# Altium schematic sheet SSI2130.SchDoc: SSI2130 VCO
size Letter; DrawnBy: Hannah Kirkland; Revision: 1; SheetNumber: 1
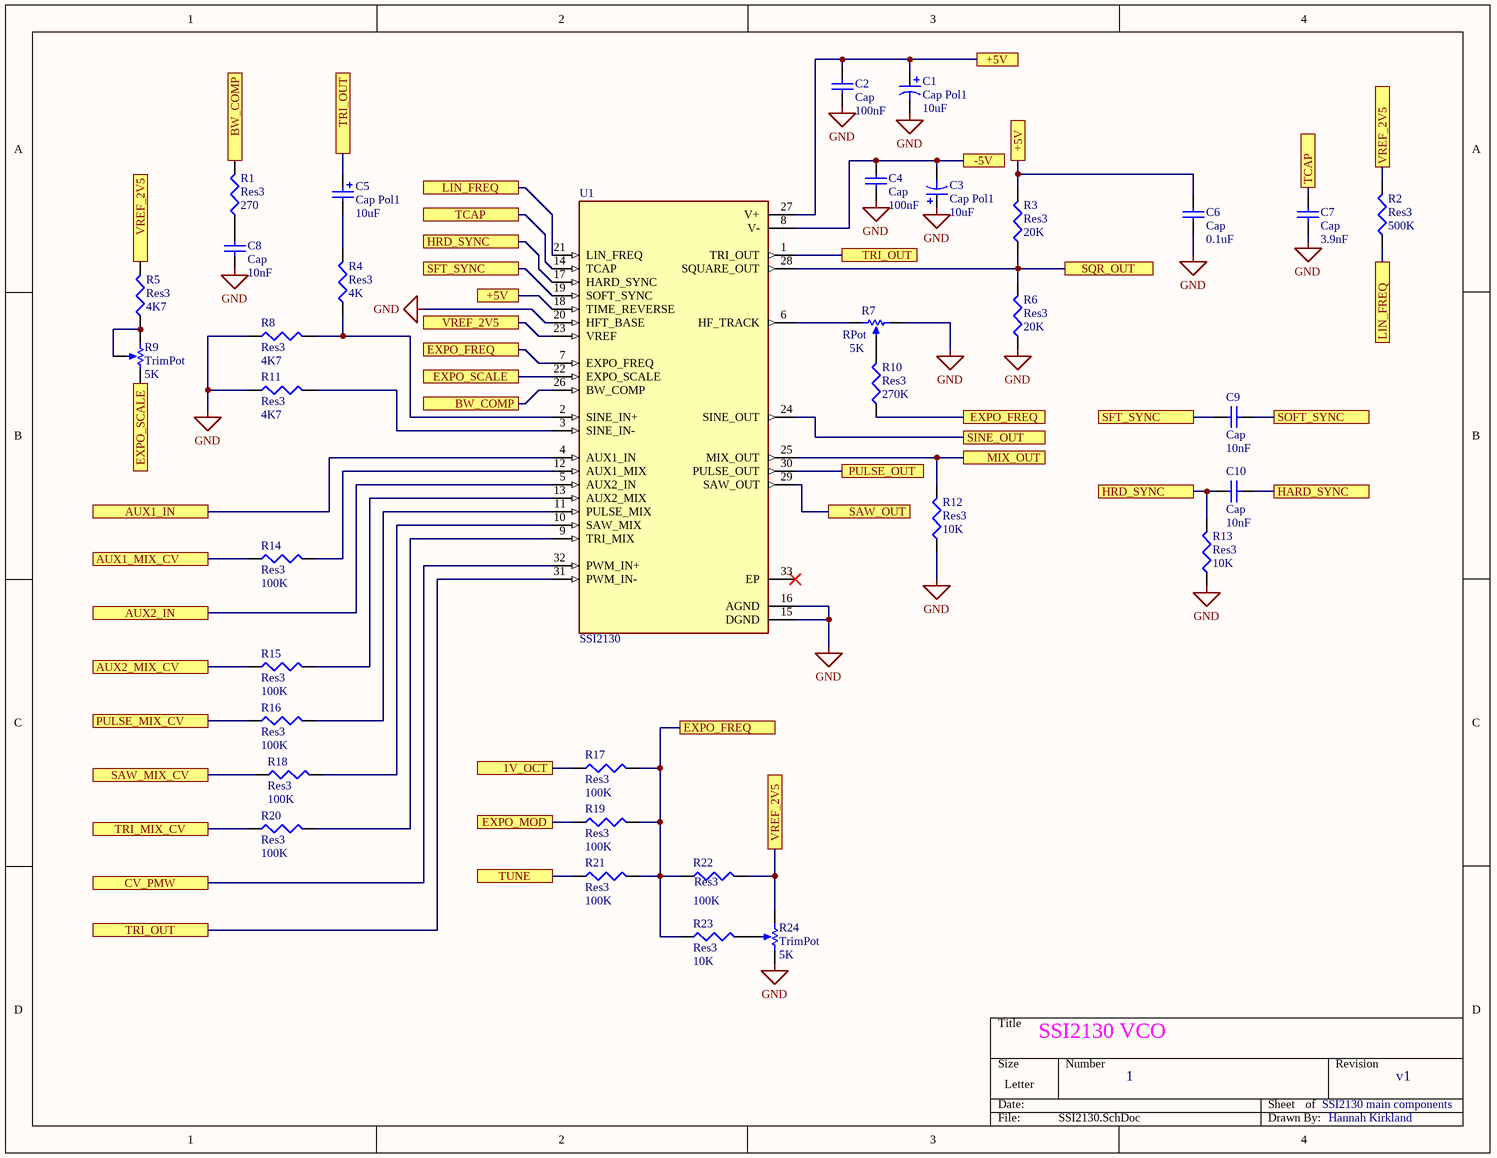
[diagram p0: SSI2130.SchDoc]

## Parts
C1  Cap Pol1  value 10uF  [RB7.6-15]
C2  Cap  value 100nF  [C1206]
C3  Cap Pol1  value 10uF  [RB7.6-15]
C4  Cap  value 100nF  [C1206]
C5  Cap Pol1  value 10uF  [RB7.6-15]
C6  Cap  value 0.1uF  [C1206]
C7  Cap  value 3.9nF  [C1206]
C8  Cap  value 10nF  [C1206]
C9  Cap  value 10nF  [C1206]
C10  Cap  value 10nF  [C1206]
R1  Res3  value 270  [C1206]
R2  Res3  value 500K  [12Z-2010]
R3  Res3  value 20K  [C1206]
R4  Res3  value 4K  [C1206]
R5  Res3  value 4K7  [C1206]
R6  Res3  value 20K  [C1206]
R7  RPot  value 5K  [VR5]
R8  Res3  value 4K7  [C1206]
R9  TrimPot  value 5K  [VR5]
R10  Res3  value 270K  [C1206]
R11  Res3  value 4K7  [C1206]
R12  Res3  value 10K  [C1206]
R13  Res3  value 10K  [C1206]
R14  Res3  value 100K  [C1206]
R15  Res3  value 100K  [C1206]
R16  Res3  value 100K  [C1206]
R17  Res3  value 100K  [C1206]
R18  Res3  value 100K  [C1206]
R19  Res3  value 100K  [C1206]
R20  Res3  value 100K  [C1206]
R21  Res3  value 100K  [C1206]
R22  Res3  value 100K  [C1206]
R23  Res3  value 10K  [C1206]
R24  TrimPot  value 5K  [VR5]
U1  SSI2130  [QFN40P400X400X90-33N]

## Ports
1V_OCT, +5V, -5V, AUX1_IN, AUX1_MIX_CV, AUX2_IN, AUX2_MIX_CV, BW_COMP, CV_PMW, EXPO_FREQ, EXPO_MOD, EXPO_SCALE, HARD_SYNC, HRD_SYNC, LIN_FREQ, MIX_OUT, PULSE_MIX_CV, PULSE_OUT, SAW_MIX_CV, SAW_OUT, SFT_SYNC, SINE_OUT, SOFT_SYNC, SQR_OUT, TCAP, TRI_MIX_CV, TRI_OUT, TUNE, VREF_2V5

## Nets
GND: C1.2 C2.1 C3.1 C4.1 C6.1 C7.1 C8.1 R6.1 R7.2(BOT) R8.1 R11.1 R12.1 R13.1 R24.2(BOT) U1.15(DGND) U1.16(AGND) U1.20(HFT_BASE)
1V_OCT: R17.1 ; port 1V_OCT
+5V: C1.1 C2.2 C6.2 R3.2 U1.18(TIME_REVERSE) U1.27(V+) ; port +5V
-5V: C3.2 C4.2 U1.8(V-) ; port -5V
AUX1_IN: U1.4(AUX1_IN) ; port AUX1_IN
AUX1_MIX_CV: R14.1 ; port AUX1_MIX_CV
AUX2_IN: U1.5(AUX2_IN) ; port AUX2_IN
AUX2_MIX_CV: R15.1 ; port AUX2_MIX_CV
BW_COMP: R1.2 U1.26(BW_COMP) ; port BW_COMP
CV_PMW: U1.32(PWM_IN+) ; port CV_PMW
EXPO_FREQ: R10.1 R17.2 R19.2 R21.2 R22.1 R23.1 U1.7(EXPO_FREQ) ; port EXPO_FREQ
EXPO_MOD: R19.1 ; port EXPO_MOD
EXPO_SCALE: R9.2(BOT) U1.22(EXPO_SCALE) ; port EXPO_SCALE
HARD_SYNC: C10.2 ; port HARD_SYNC
HRD_SYNC: C10.1 R13.2 U1.17(HARD_SYNC) ; port HRD_SYNC
LIN_FREQ: R2.1 U1.21(LIN_FREQ) ; port LIN_FREQ
MIX_OUT: R12.2 U1.25(MIX_OUT) ; port MIX_OUT
PULSE_MIX_CV: R16.1 ; port PULSE_MIX_CV
PULSE_OUT: U1.30(PULSE_OUT) ; port PULSE_OUT
SAW_MIX_CV: R18.1 ; port SAW_MIX_CV
SAW_OUT: U1.29(SAW_OUT) ; port SAW_OUT
SFT_SYNC: C9.1 U1.19(SOFT_SYNC) ; port SFT_SYNC
SINE_OUT: U1.24(SINE_OUT) ; port SINE_OUT
SOFT_SYNC: C9.2 ; port SOFT_SYNC
SQR_OUT: R3.1 R6.2 U1.28(SQUARE_OUT) ; port SQR_OUT
TCAP: C7.2 U1.14(TCAP) ; port TCAP
TRI_MIX_CV: R20.1 ; port TRI_MIX_CV
TRI_OUT: C5.1 U1.1(TRI_OUT) U1.31(PWM_IN-) ; port TRI_OUT
TUNE: R21.1 ; port TUNE
VREF_2V5: R2.2 R5.2 R22.2 R24.1(TOP) U1.23(VREF) ; port VREF_2V5
NetC5_2: C5.2 R4.2
NetC8_2: C8.2 R1.1
NetR4_1: R4.1 R8.2 U1.2(SINE_IN+)
NetR5_1: R5.1 R9.1(TOP) R9.3(TAP)
NetR7_1: R7.1(TOP) U1.6(HF_TRACK)
NetR7_3: R7.3(TAP) R10.2
NetR11_2: R11.2 U1.3(SINE_IN-)
NetR14_2: R14.2 U1.12(AUX1_MIX)
NetR15_2: R15.2 U1.13(AUX2_MIX)
NetR16_2: R16.2 U1.11(PULSE_MIX)
NetR18_2: R18.2 U1.10(SAW_MIX)
NetR20_2: R20.2 U1.9(TRI_MIX)
NetR23_2: R23.2 R24.3(TAP)

Not connected (* = marked no-connect by the designer): U1 33(EP)*

## Notes on the sheet
- SSI2130 VCO
- 1
- SSI2130 main components
- v1
- Hannah Kirkland

## Library data of the parts
C1 C3 C5 = Cap Pol1: Polarized Capacitor (Radial); Published: 8-Jun-2000; LatestRevisionDate: 17-Jul-2002; LatestRevisionNote: Re-released for DXP Platform.; PackageReference: RB7.6-15; Publisher: Altium Limited; PackageDescription: Polarized Capacitor (Radial); 2 Leads
C2 C4 C6-C10 = Cap: Capacitor; Published: 8-Jun-2000; LatestRevisionDate: 17-Jul-2002; LatestRevisionNote: Re-released for DXP Platform.; PackageReference: RAD-0.3; Publisher: Altium Limited; PackageDescription: Radial Cap, Thru-Hole; 2 Leads; 0.3 in Pin Spacing
R1-R6 R8 R10-R23 = Res3: Resistor; Published: 8-Jun-2000; LatestRevisionDate: 29-May-2009; LatestRevisionNote: IPC-7351 Footprint Added.; PackageReference: J1-0603; Publisher: Altium Limited; PackageDescription: Chip Resistor
R7 R9 R24 = RPot: Potentiometer; Sim Note: Enter the Resistance value and the set point into parameter fields.; Set Position: 0.5; Published: 8-Jun-2000; LatestRevisionDate: 17-Jul-2002; LatestRevisionNote: Re-released for DXP Platform.; PackageReference: VR5; Publisher: Altium Limited; PackageDescription: Variable Resistor, Thru-Hole; 3 Leads
U1 = SSI2130: Voltage controlled oscillator subsystem for high-performance electronic musical instruments; MF: Sound Semiconductor; Check_prices: https://www.snapeda.com/parts/SSI2130/Sound%20Semiconductor/view-part/5718733/?ref=eda; SnapEDA_Link: https://www.snapeda.com/parts/SSI2130/Sound%20Semiconductor/view-part/5718733/?ref=snap; Price: None; MP: SSI2130; Value: *; Availability: Unavailable; Package: Package